# Altium project PAS.PrjPCB
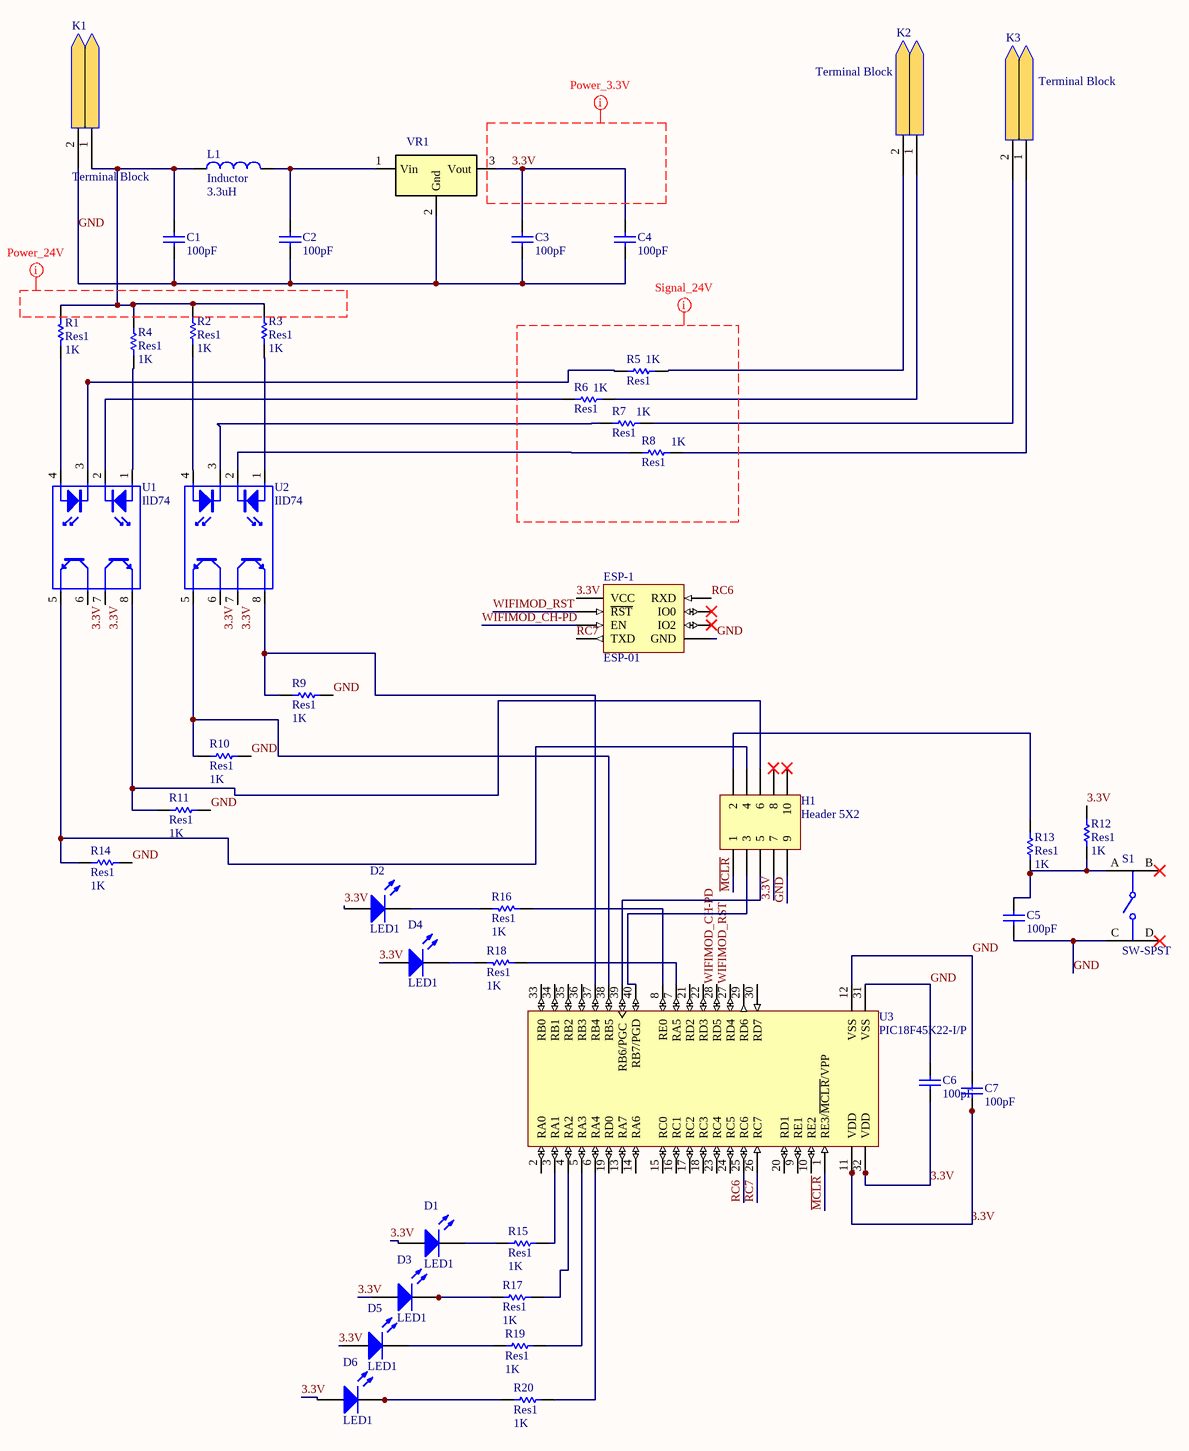
[diagram p0: Pas_Schematic.SchDoc]
1 sheet, 44 parts. Net scope: global (net labels, ports and power ports of the same name join across sheets).
Board file: Pas PCB.PcbDoc

## Sheet Pas_Schematic.SchDoc
size A3

### Parts
C1  value 100pF  [RADIAL_0.2]  (hidden comment: Capacitor)
C2  value 100pF  [RADIAL_0.2]  (hidden comment: Capacitor)
C3  value 100pF  [RADIAL_0.2]  (hidden comment: Capacitor)
C4  value 100pF  [RADIAL_0.2]  (hidden comment: Capacitor)
C5  value 100pF  [RADIAL_0.2]  (hidden comment: Capacitor)
C6  value 100pF  [RADIAL_0.2]  (hidden comment: Capacitor)
C7  value 100pF  [RADIAL_0.2]  (hidden comment: Capacitor)
D1  LED1  [RADIAL_0.2]
D2  LED1  [RADIAL_0.2]
D3  LED1  [RADIAL_0.2]
D4  LED1  [RADIAL_0.2]
D5  LED1  [RADIAL_0.2]
D6  LED1  [RADIAL_0.2]
ESP-1  ESP-01  [ESP-01]
H1  Header 5X2  [HDR2X5]
K1  Terminal Block  [Altech MV-252]
K2  Terminal Block  [Altech MV-252]
K3  Terminal Block  [Altech MV-252]
L1  Inductor  value 3.3uH  [RADIAL_3.5]
R1  Res1  value 1K  [AXIAL-0.3]
R2  Res1  value 1K  [AXIAL-0.3]
R3  Res1  value 1K  [AXIAL-0.3]
R4  Res1  value 1K  [AXIAL-0.3]
R5  Res1  value 1K  [AXIAL-0.3]
R6  Res1  value 1K  [AXIAL-0.3]
R7  Res1  value 1K  [AXIAL-0.3]
R8  Res1  value 1K  [AXIAL-0.3]
R9  Res1  value 1K  [AXIAL-0.3]
R10  Res1  value 1K  [AXIAL-0.3]
R11  Res1  value 1K  [AXIAL-0.3]
R12  Res1  value 1K  [AXIAL-0.3]
R13  Res1  value 1K  [AXIAL-0.3]
R14  Res1  value 1K  [AXIAL-0.3]
R15  Res1  value 1K  [AXIAL-0.3]
R16  Res1  value 1K  [AXIAL-0.3]
R17  Res1  value 1K  [AXIAL-0.3]
R18  Res1  value 1K  [AXIAL-0.3]
R19  Res1  value 1K  [AXIAL-0.3]
R20  Res1  value 1K  [AXIAL-0.3]
S1  SW-SPST  [SW-SPST-1]
U1  IlD74  [DIP-8]
U2  IlD74  [DIP-8]
U3  PIC18F45K22-I/P  [MCHP-PDIP-P40]
VR1  REG  [SIP3]  (value not drawn)

### Nets
3.3V: C3.1 C4.1 C6.1 C7.1 D1.1(A) D2.1(A) D3.1(A) D4.1(A) D5.1(A) D6.1(A) ESP-1.8(VCC) H1.7 R12.2 U1.6(C) U1.7(C) U2.6(C) U2.7(C) U3.11(VDD) U3.32(VDD) VR1.3(Vout)
GND: C1.2 C2.2 C3.2 C4.2 C5.2 C6.2 C7.2 ESP-1.1(GND) H1.9 K1.2(Cable_2) R9.1 R10.1 R11.1 R14.1 S1.C(NO) U3.12(VSS) U3.31(VSS) VR1.2(Gnd)
~{MCLR}: H1.1 U3.1(RE3/~{MCLR}/VPP)
RC6: ESP-1.4(RXD) U3.25(RC6)
RC7: ESP-1.5(TXD) U3.26(RC7)
WIFIMOD_CH-PD: ESP-1.6(EN) U3.28(RD5)
WIFIMOD_RST: ESP-1.7(~{RST}) U3.27(RD4)
NetC1_1: C1.1 K1.1(Cable_1) L1.1 R1.1 R2.2 R3.2 R4.2
NetC2_1: C2.1 L1.2 VR1.1(Vin)
NetC5_1: C5.1 R12.1 R13.1 S1.A(COMMON)
NetD1_2: D1.2(K) R15.2
NetD2_2: D2.2(K) R16.2
NetD3_2: D3.2(K) R17.1
NetD4_2: D4.2(K) R18.2
NetD5_2: D5.2(K) R19.1
NetD6_2: D6.2(K) R20.1
NetH1_2: H1.2 R13.2
NetH1_3: H1.3 U3.40(RB7/PGD)
NetH1_4: H1.4 R14.2 U1.5(E)
NetH1_5: H1.5 U3.39(RB6/PGC)
NetH1_6: H1.6 R11.2 U1.8(E)
NetK2_1: K2.1(Cable_1) R6.2
NetK2_2: K2.2(Cable_2) R5.2
NetK3_1: K3.1(Cable_1) R8.2
NetK3_2: K3.2(Cable_2) R7.2
NetR1_2: R1.2 U1.4(A)
NetR2_1: R2.1 U2.4(A)
NetR3_1: R3.1 U2.1(A)
NetR4_1: R4.1 U1.1(A)
NetR5_1: R5.1 U1.3(K)
NetR6_1: R6.1 U1.2(K)
NetR7_1: R7.1 U2.3(K)
NetR8_1: R8.1 U2.2(K)
NetR9_2: R9.2 U2.8(E) U3.37(RB4)
NetR10_2: R10.2 U2.5(E) U3.38(RB5)
NetR15_1: R15.1 U3.3(RA1)
NetR16_1: R16.1 U3.8(RE0)
NetR17_2: R17.2 U3.4(RA2)
NetR18_1: R18.1 U3.7(RA5)
NetR19_2: R19.2 U3.5(RA3)
NetR20_2: R20.2 U3.6(RA4)

Not connected (* = marked no-connect by the designer): ESP-1 2(IO2)* 3(IO0)*; H1 8* 10*; S1 B(COMMON)* D(NO)*; U3 2(RA0) 9(RE1) 10(RE2) 13(RA7) 14(RA6) 15(RC0) 16(RC1) 17(RC2) 18(RC3) 19(RD0) 20(RD1) 21(RD2) 22(RD3) 23(RC4) 24(RC5) 29(RD6) 30(RD7) 33(RB0) 34(RB1) 35(RB2) 36(RB3)

### Layout directives
net class Power_24V; rule Routing Topology [Topology - Daisy-Simple]: (no net found under the mark)
net class Signal_24V: (no net found under the mark)
net class Power_3.3V; rule Routing Topology [Topology - Daisy-Simple]: 3.3V

### Library data of the parts
D1-D6 = LED1: Typical RED GaAs LED; Published: 8-Jun-2000; LatestRevisionDate: 08-Jul-2005; LatestRevisionNote: Mech Layer 1 removed.; PackageReference: LED-1; Publisher: Altium Limited; PackageDescription: LED; 2 Leads
ESP-1 = ESP-01: 802.11b/g/n Wi-Fi SOC module; LatestRevisionDate: 17-Jul-2002; LatestRevisionNote: Re-released for DXP Platform.; Publisher: Altium Limited
H1 = Header 5X2: Header, 5-Pin, Dual row; LatestRevisionDate: 17-Jul-2002; LatestRevisionNote: Re-released for DXP Platform.; Publisher: Altium Limited
L1 = Inductor: Code_IEC: 1005; Published: 8-Jun-2000; LatestRevisionDate: 29-May-2009; LatestRevisionNote: IPC-7351 Footprint Added.; PackageReference: 0402-A; Publisher: Altium Limited; PackageDescription: Chip Inductor; Code_JEITA: 0402
R1-R20 = Res1: Resistor; Published: 8-Jun-2000; LatestRevisionDate: 17-Jul-2002; LatestRevisionNote: Re-released for DXP Platform.; PackageReference: AXIAL-0.3; Publisher: Altium Limited; PackageDescription: Axial Device, Thru-Hole; 2 Leads; 0.3 in Pin Spacing
S1 = SW-SPST: 4-pin Single-Pole, Single-Throw Switch; pin to pad: A>1 B>2 C>3 D>4; Published: 24-Mar-1999; LatestRevisionDate: 17-Jul-2002; LatestRevisionNote: Re-released for DXP Platform.; PackageReference: SPST-2; Publisher: Altium Limited; PackageDescription: Switch; 2 Leads
U1 U2 = IlD74: 8-pin Dual Optocoupler with NPN Transistor Output; Published: 24-Mar-1999; LatestRevisionDate: 04-Mar-2005; LatestRevisionNote: Sch pins 3 & 4 Swapped.; DatasheetVersion: Nov-2003; PackageReference: DIP-4; Publisher: Altium Limited
U3 = PIC18F45K22-I/P: Low-Power, High-Performance Microcontroller with XLP Technology, 64 MHz, 35 I/O, -40 to 85 degC, 40-pin PDIP (P40), Tube; Manufacturer: Microchip; EEPROM Data Memory (bytes): 256; Internal Oscillator: 16 MHz, 31 kHz; Program Memory KWords: 16; I/O Pins: 35; RAM: 1536; Max. CPU Speed MHz: 64; Operation Voltage Range: 2.3V - 5.5V; Digital Communication: 2 -A/E/USART, 2 -MSSP(SPI/I2C); Timers: 3 - 8-bit, 4 - 16-bit; Program Memory KBytes: 32; # of A/D Channels: 28; Memory Type: Flash; PartNumber: PIC18F45K22-I/P; ComponentLink1Description: Datasheet; ComponentLink2Description: Package Specification; DatasheetVersion: Rev. F; ComponentLink3URL: Product URL:http://www.microchip.com/datasheet/PIC18F45K22; ComponentLink1URL: http://ww1.microchip.com/downloads/en/DeviceDoc/41412F.pdf; Packing: TUBE; ComponentLink2URL: http://www.microchip.com/stellent/groups/techpub_sg/documents/packagingspec/en012702.pdf; PackageReference: PDIP-P40; ComponentLink3Description: URL Link1; PackageVersion: C04-016B, 04/2013; RoHS: TRUE; Mounting Technology: Through Hole; PackageDescription: 40-Lead Plastic Dual In-Line Package, Body 51.75 x 13.53 mm, Pitch 2.54 mm
VR1 = R-783.3-0.5: Non-Isolated DC/DC Converters 0.5A DC/DC REG 4.75-34Vin 3.3Vout
C1-C7 = Capacitor: Published: 8-Jun-2000; LatestRevisionDate: 17-Jul-2002; LatestRevisionNote: Re-released for DXP Platform.; PackageReference: RAD-0.3; Publisher: Altium Limited; PackageDescription: Radial Cap, Thru-Hole; 2 Leads; 0.3 in Pin Spacing